# EAGLE design led kocka gornja (EAGLE 8.4.3)
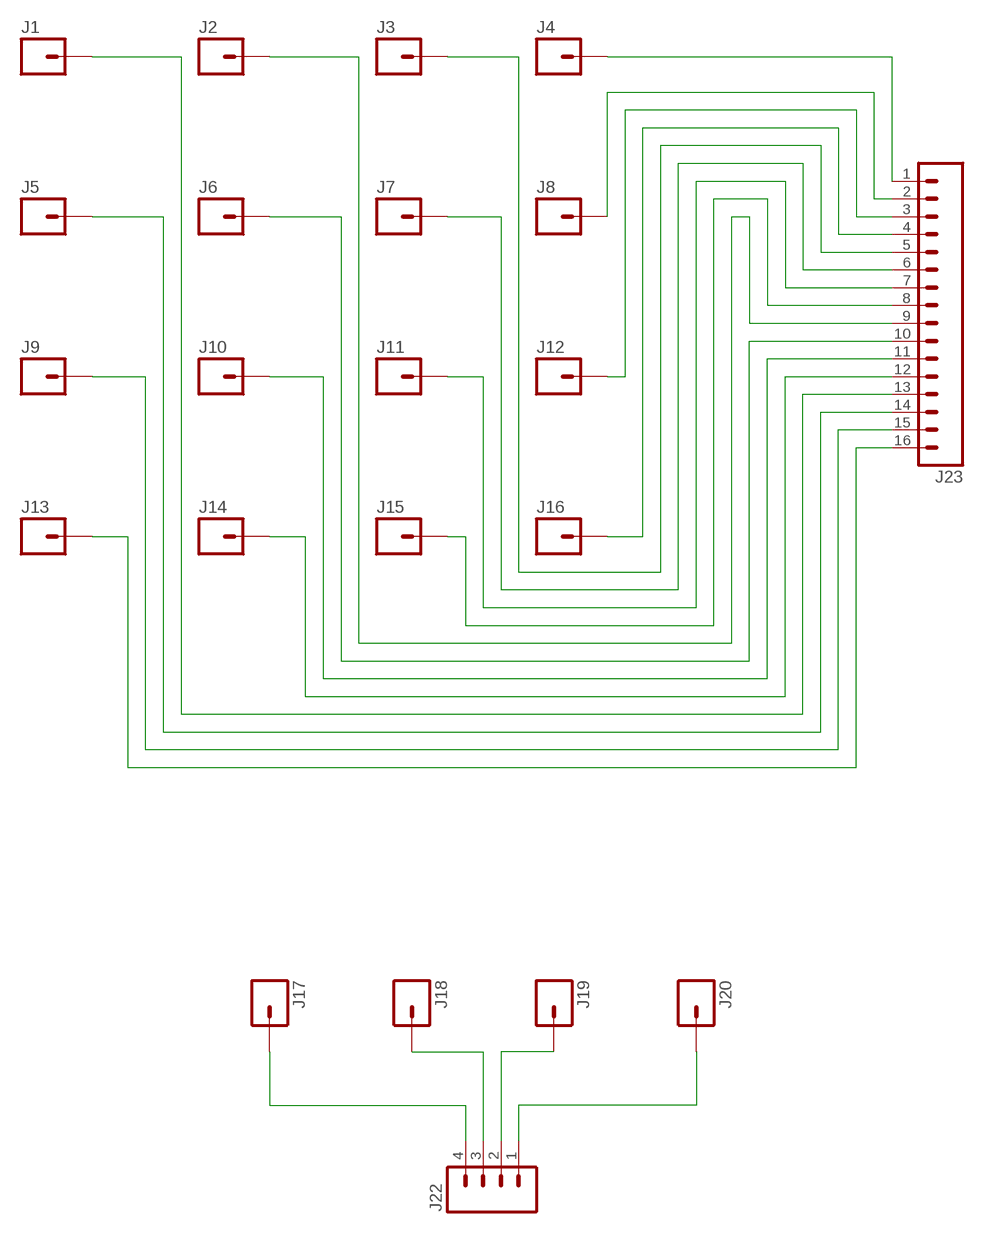
[diagram p0: schematic, sheet 1]

## Parts
J1  M01NOSILK-KIT  [1X01NS-KIT]
J2  M01NOSILK-KIT  [1X01NS-KIT]
J3  M01NOSILK-KIT  [1X01NS-KIT]
J4  M01NOSILK-KIT  [1X01NS-KIT]
J5  M01NOSILK-KIT  [1X01NS-KIT]
J6  M01NOSILK-KIT  [1X01NS-KIT]
J7  M01NOSILK-KIT  [1X01NS-KIT]
J8  M01NOSILK-KIT  [1X01NS-KIT]
J9  M01NOSILK-KIT  [1X01NS-KIT]
J10  M01NOSILK-KIT  [1X01NS-KIT]
J11  M01NOSILK-KIT  [1X01NS-KIT]
J12  M01NOSILK-KIT  [1X01NS-KIT]
J13  M01NOSILK-KIT  [1X01NS-KIT]
J14  M01NOSILK-KIT  [1X01NS-KIT]
J15  M01NOSILK-KIT  [1X01NS-KIT]
J16  M01NOSILK-KIT  [1X01NS-KIT]
J17  M01NOSILK-KIT  [1X01NS-KIT]
J18  M01NOSILK-KIT  [1X01NS-KIT]
J19  M01NOSILK-KIT  [1X01NS-KIT]
J20  M01NOSILK-KIT  [1X01NS-KIT]
J22  M04LONGPADS  [1X04_LONGPADS]
J23  M16LONGPADS  [1X16_LONGPADS]

## Nets
N$1: J4.1 J23.1
N$2: J8.1 J23.2
N$3: J12.1 J23.3
N$4: J16.1 J23.4
N$5: J3.1 J23.5
N$6: J7.1 J23.6
N$7: J11.1 J23.7
N$8: J15.1 J23.8
N$9: J2.1 J23.9
N$10: J6.1 J23.10
N$11: J14.1 J23.12
N$12: J1.1 J23.13
N$13: J10.1 J23.11
N$14: J5.1 J23.14
N$15: J9.1 J23.15
N$16: J13.1 J23.16
N$17: J17.1 J22.4
N$18: J20.1 J22.1
N$19: J18.1 J22.3
N$20: J19.1 J22.2

## Library data of the parts
J1-J20 = SparkFun-Connectors:M01: Header 1 Standard 1-pin 0.1" header. Use with straight break away headers (SKU : PRT-00116), right angle break away headers (PRT-00553), swiss pins (PRT-00743), machine pins (PRT-00117), and female headers (PRT-00115). SMTSO-256-ET is a "flush mount" nut for a 4-40 screw. The older package used to be too tight, and did not allow it to sit properly thru the drill hit. The latest (0.165DIA) fits nice and snug.
J22 = SparkFun-Connectors:M04: Header 4 Standard 4-pin 0.1" header. Use with straight break away headers (SKU : PRT-00116), right angle break away headers (PRT-00553), swiss pins (PRT-00743), machine pins (PRT-00117), and female headers (PRT-00115). Molex polarized connector foot print use with SKU : PRT-08231 with associated crimp pins and housings. 1MM SMD Version SKU: PRT-10208; PROD_ID: CONN-09696
J23 = SparkFun-Connectors:M16: 1x16 .1" header

## Board
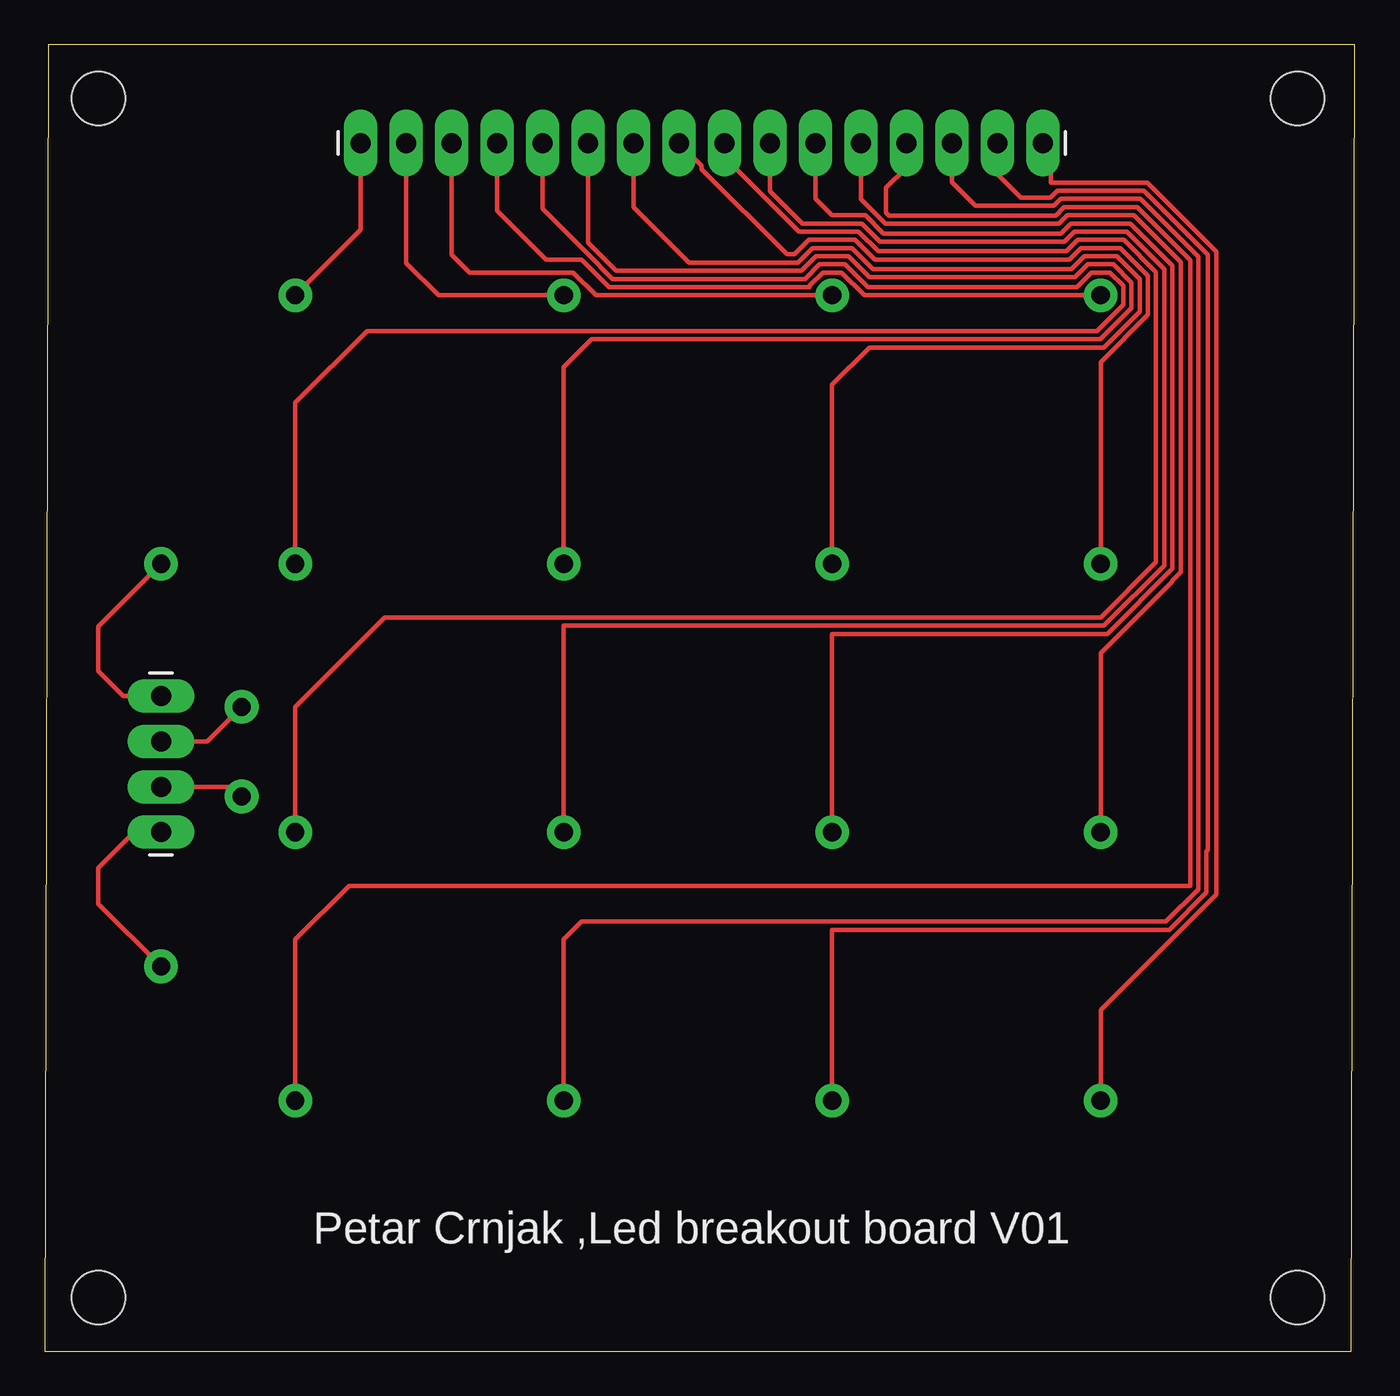
[diagram p1: board, top side]

Size 73.2 x 73 mm. Coordinates in mm from the lower left corner, seen from the top.
Outline: 0,0 73,0 73.2,73 0.2,73 0,0
Copper layers (1*16): Top 0.035mm / dielectric 1.5mm / Bottom 0.035mm
Design rules "default *": minimum track width 10mil, minimum drill 0.35mm, track to track 8mil, track to pad 8mil, pad to pad 8mil, via to via 8mil, smd to smd 8mil, copper to edge 40mil, drill to drill 6mil, minimum pad ring 10mil, minimum via ring 8mil, stop-mask expansion 4mil, vias tented up to drill 0mil, thermal gap 10mil
Holes 3 mm at 3,70 70,70 70,3 3,3

### Footprints (pad centres in the part's own frame; a part is rotated, then mirrored left to right if it is on the bottom)
1X01NS-KIT = drill 1.016 pad 1.88: 1 0,0
1X04_LONGPADS = drill 1.118 pad 1.88 long: 1 0,0; 2 2.54,0; 3 5.08,0; 4 7.62,0
1X16_LONGPADS = drill 1.118 pad 1.88 long: 1 0,0; 2 2.54,0; 3 5.08,0; 4 7.62,0; 5 10.16,0; 6 12.7,0; 7 15.24,0; 8 17.78,0; 9 20.32,0; 10 22.86,0; 11 25.4,0; 12 27.94,0; 13 30.48,0; 14 33.02,0; 15 35.56,0; 16 38.1,0

### Placement (x,y rotation side)
J1  14,14 0 top
J2  14,29 90 top
J3  14,44 90 top
J4  14,59 90 top
J5  29,14 0 top
J6  29,29 0 top
J7  29,44 0 top
J8  29,59 0 top
J9  44,14 90 top
J10  44,29 90 top
J11  44,44 90 top
J12  44,59 90 top
J13  59,14 0 top
J14  59,29 0 top
J15  59,44 270 top
J16  59,59 0 top
J17  6.5,44 90 top
J18  11,36 90 top
J19  11,31 90 top
J20  6.5,21.5 90 top
J22  6.5,29 90 top
J23  17.66,67.51 0 top

### Tracks (layer width: path | path; a pad name or v marks a point on that pad's centre or on a via)
N$1
  Top 0.254: J23.1 17.66,62.66 J4.1
N$2
  Top 0.254: J8.1 22,59 20.2,60.8 J23.2
N$3
  Top 0.254: J12.1 30.8,59 29.53,60.27 23.73,60.27 22.74,61.26 J23.3
N$4
  Top 0.254: J16.1 45.8,59 44.53,60.27 43.47,60.27 42.73,59.53 42.73,59.46 31.54,59.46 30,61 28,61 25.28,63.72 J23.4
N$5
  Top 0.254: J3.1 14,53 18,57 58.8,57 60.27,58.47 60.27,59.53 59.53,60.27 58.47,60.27 57.66,59.46 45.98,59.46 44.72,60.73 43.28,60.73 42.47,59.91 31.73,59.91 30.32,61.32 30.19,61.46 27.82,63.83 J23.5
N$6
  Top 0.254: J7.1 29,55 30.54,56.54 58.98,56.54 60.73,58.28 60.73,59.72 59.72,60.73 58.28,60.73 57.56,60 46.09,60 44.91,61.18 43.09,61.18 42.28,60.37 31.92,60.37 30.36,61.93 J23.6
N$7
  Top 0.254: J11.1 44,54 46.09,56.09 59.17,56.09 61.18,58.09 61.18,59.91 59.91,61.18 58.09,61.18 57.37,60.46 46.28,60.46 45.09,61.64 42.91,61.64 42.09,60.83 36,60.83 32.9,63.93 J23.7
N$8
  Top 0.254: J15.1 59,55.26 61.64,57.91 61.64,60.09 60.09,61.64 57.91,61.64 57.26,61 46.38,61 45.28,62.1 42.72,62.1 41.9,61.29 41.47,61.29 36.71,66.04 36.71,66.24 J23.8
N$9
  Top 0.254: J2.1 | J2.1 14,36 19,41 59,41 62.1,44.1 62.1,60.28 60.28,62.1 57.72,62.1 57.08,61.46 46.57,61.46 45.47,62.56 42.15,62.56 37.98,66.72 J23.9
N$10
  Top 0.254: J6.1 | J6.1 29,40.54 59.19,40.54 62.56,43.91 62.56,60.47 60.47,62.56 57.53,62.56 56.97,62 46.67,62 45.66,63.01 42.34,63.01 40.52,64.83 J23.10
N$11
  Top 0.254: J14.1 59,39 63,43 63,43.06 63.47,43.53 63.47,60.85 60.85,63.47 57.15,63.47 56.68,63 47,63 46.97,63 45.6,64.37 J23.12
N$12
  Top 0.254: J1.1 | J1.1 14,23 17,26 64,26 64,60.97 61.04,63.93 56.96,63.93 56.49,63.46 47.16,63.46 47,63.62 47,65 48.14,66.14 J23.13
N$13
  Top 0.254: J10.1 44,40 | 44,40 | 44,40 44,40.09 59.38,40.09 63.01,43.72 63.01,60.66 60.66,63.01 57.34,63.01 56.78,62.46 46.87,62.46 45.85,63.47 44,63.47 43.06,64.41 J23.11
N$14
  Top 0.254: J5.1 29,23 30,24 62.65,24 64.46,25.81 64.46,61.16 61.23,64.39 56.77,64.39 56.38,64 52,64 50.68,65.32 J23.14
N$15
  Top 0.254: J9.1 | J9.1 44,23.54 62.84,23.54 64.91,25.62 64.91,27.91 65,28 65,61.26 61.42,64.84 56.58,64.84 56.2,64.46 54.54,64.46 53.22,65.78 J23.15
N$16
  Top 0.254: J13.1 59,19.06 65.46,25.52 65.46,61.45 61.61,65.3 56.21,65.3 56.21,67.06 J23.16
N$17
  Top 0.254: J17.1 3,40.5 3,38 4.38,36.62 J22.4
N$18
  Top 0.254: J20.1 3,25 3,27 5,29 J22.1
N$19
  Top 0.254: J22.3 9.08,34.08 J18.1
N$20
  Top 0.254: J22.2 10.46,31.54 J19.1

### Text on the board
tNames: Petar Crnjak ,Led breakout board V01